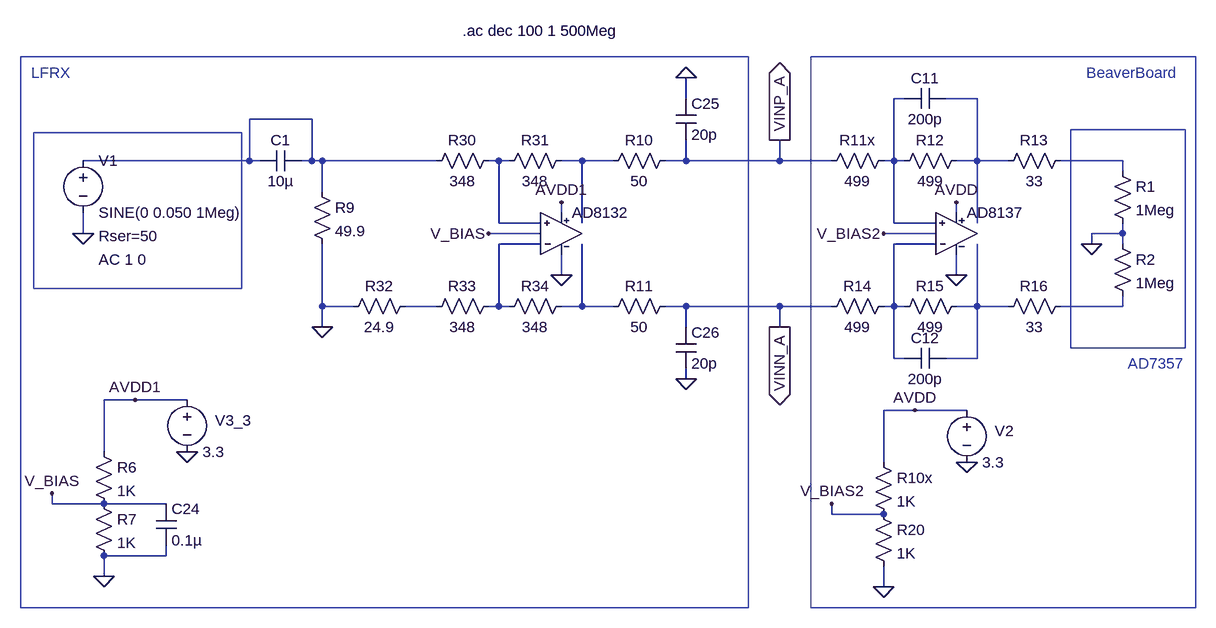
[diagram p0: schematic AD8132-AD8137.asc]
AD8132-AD8137.asc, the LTspice schematic file:
Version 4
SHEET 1 1456 680
WIRE 368 -112 368 -144
WIRE 704 -112 688 -112
WIRE 816 -112 768 -112
WIRE -208 -80 -304 -80
WIRE -304 -16 -304 -80
WIRE -304 -16 -560 -16
WIRE -288 -16 -304 -16
WIRE -208 -16 -208 -80
WIRE -208 -16 -224 -16
WIRE -192 -16 -208 -16
WIRE -16 -16 -192 -16
WIRE 80 -16 64 -16
WIRE 96 -16 80 -16
WIRE 208 -16 176 -16
WIRE 256 -16 208 -16
WIRE 368 -16 368 -48
WIRE 368 -16 336 -16
WIRE 512 -16 512 -48
WIRE 512 -16 368 -16
WIRE 592 -16 512 -16
WIRE 688 -16 688 -112
WIRE 688 -16 672 -16
WIRE 704 -16 688 -16
WIRE 816 -16 816 -112
WIRE 816 -16 784 -16
WIRE 864 -16 816 -16
WIRE 1040 -16 944 -16
WIRE 1040 0 1040 -16
WIRE -192 32 -192 -16
WIRE 176 64 176 48
WIRE 784 64 784 48
WIRE 80 80 80 -16
WIRE 144 80 80 80
WIRE 208 80 208 -16
WIRE 688 80 688 -16
WIRE 752 80 688 80
WIRE 816 80 816 -16
WIRE -560 96 -560 64
WIRE 144 96 64 96
WIRE 752 96 672 96
WIRE 1040 96 1040 80
WIRE 1040 96 992 96
WIRE 144 112 80 112
WIRE 752 112 688 112
WIRE 992 112 992 96
WIRE 1040 112 1040 96
WIRE 176 160 176 128
WIRE 784 160 784 128
WIRE -192 208 -192 112
WIRE -144 208 -192 208
WIRE -16 208 -64 208
WIRE 80 208 80 112
WIRE 80 208 64 208
WIRE 96 208 80 208
WIRE 208 208 208 112
WIRE 208 208 176 208
WIRE 256 208 208 208
WIRE 368 208 336 208
WIRE 512 208 368 208
WIRE 592 208 512 208
WIRE 688 208 688 112
WIRE 688 208 672 208
WIRE 704 208 688 208
WIRE 816 208 816 112
WIRE 816 208 784 208
WIRE 864 208 816 208
WIRE 1040 208 1040 192
WIRE 1040 208 944 208
WIRE -192 240 -192 208
WIRE 368 240 368 208
WIRE 512 240 512 208
WIRE 688 288 688 208
WIRE 704 288 688 288
WIRE 816 288 816 208
WIRE 816 288 768 288
WIRE 368 320 368 304
WIRE -480 352 -528 352
WIRE -400 352 -480 352
WIRE 720 368 672 368
WIRE 800 368 720 368
WIRE -528 432 -528 352
WIRE 672 448 672 368
WIRE -608 512 -608 496
WIRE -528 512 -608 512
WIRE -432 512 -528 512
WIRE 592 528 592 512
WIRE 672 528 592 528
WIRE -432 592 -432 576
WIRE -432 592 -528 592
WIRE -528 624 -528 592
WIRE 672 640 672 608
FLAG 512 240 VINN_A
IOPIN 512 240 Out
FLAG 512 -48 VINP_A
IOPIN 512 -48 Out
FLAG -560 96 0
FLAG -480 352 AVDD1
FLAG -400 432 0
FLAG 176 48 AVDD1
FLAG 176 160 0
FLAG -528 624 0
FLAG -608 496 V_BIAS
FLAG 64 96 V_BIAS
FLAG 368 -144 0
FLAG 368 320 0
FLAG 784 48 AVDD
FLAG 784 160 0
FLAG 672 96 V_BIAS2
FLAG 720 368 AVDD
FLAG 800 448 0
FLAG 672 640 0
FLAG 592 512 V_BIAS2
FLAG 992 112 0
FLAG -192 240 0
SYMBOL res 80 192 R90
WINDOW 0 0 56 VBottom 0
WINDOW 3 32 56 VTop 0
SYMATTR InstName R33
SYMATTR Value 348
SYMATTR SpiceLine tol=1 pwr=0.1
SYMBOL res 80 -32 R90
WINDOW 0 0 56 VBottom 0
WINDOW 3 32 56 VTop 0
SYMATTR InstName R30
SYMATTR Value 348
SYMATTR SpiceLine tol=1 pwr=0.1
SYMBOL res 192 192 R90
WINDOW 0 0 56 VBottom 0
WINDOW 3 32 56 VTop 0
SYMATTR InstName R34
SYMATTR Value 348
SYMATTR SpiceLine tol=1 pwr=0.1
SYMBOL res 192 -32 R90
WINDOW 0 0 56 VBottom 0
WINDOW 3 32 56 VTop 0
SYMATTR InstName R31
SYMATTR Value 348
SYMATTR SpiceLine tol=1 pwr=0.1
SYMBOL voltage -560 -32 R0
WINDOW 123 24 168 Left 0
WINDOW 39 24 132 Left 0
SYMATTR Value2 AC 1 0
SYMATTR SpiceLine Rser=50
SYMATTR InstName V1
SYMATTR Value SINE(0 0.050 1Meg)
SYMBOL voltage -400 336 R0
WINDOW 123 0 0 Left 0
WINDOW 39 0 0 Left 0
WINDOW 0 43 48 Left 0
SYMATTR InstName V3_3
SYMATTR Value 3.3
SYMBOL ad8132 176 96 R0
SYMATTR InstName AD8132
SYMBOL res -544 416 R0
SYMATTR InstName R6
SYMATTR Value 1K
SYMATTR SpiceLine tol=1 pwr=0.1
SYMBOL res -544 496 R0
SYMATTR InstName R7
SYMATTR Value 1K
SYMATTR SpiceLine tol=1 pwr=0.1
SYMBOL cap -448 512 R0
SYMATTR InstName C24
SYMATTR Value 0.1µ
SYMBOL res -208 16 R0
SYMATTR InstName R9
SYMATTR Value 49.9
SYMBOL res -48 192 R90
WINDOW 0 0 56 VBottom 0
WINDOW 3 32 56 VTop 0
SYMATTR InstName R32
SYMATTR Value 24.9
SYMBOL res 352 -32 R90
WINDOW 0 0 56 VBottom 0
WINDOW 3 32 56 VTop 0
SYMATTR InstName R10
SYMATTR Value 50
SYMBOL res 352 192 R90
WINDOW 0 0 56 VBottom 0
WINDOW 3 32 56 VTop 0
SYMATTR InstName R11
SYMATTR Value 50
SYMBOL cap 352 -112 R0
SYMATTR InstName C25
SYMATTR Value 20p
SYMBOL cap 352 240 R0
SYMATTR InstName C26
SYMATTR Value 20p
SYMBOL res 688 192 R90
WINDOW 0 0 56 VBottom 0
WINDOW 3 32 56 VTop 0
SYMATTR InstName R14
SYMATTR Value 499
SYMATTR SpiceLine tol=1 pwr=0.1
SYMBOL res 688 -32 R90
WINDOW 0 0 56 VBottom 0
WINDOW 3 32 56 VTop 0
SYMATTR InstName R11x
SYMATTR Value 499
SYMATTR SpiceLine tol=1 pwr=0.1
SYMBOL res 800 192 R90
WINDOW 0 0 56 VBottom 0
WINDOW 3 32 56 VTop 0
SYMATTR InstName R15
SYMATTR Value 499
SYMATTR SpiceLine tol=1 pwr=0.1
SYMBOL res 800 -32 R90
WINDOW 0 0 56 VBottom 0
WINDOW 3 32 56 VTop 0
SYMATTR InstName R12
SYMATTR Value 499
SYMATTR SpiceLine tol=1 pwr=0.1
SYMBOL res 960 -32 R90
WINDOW 0 0 56 VBottom 0
WINDOW 3 32 56 VTop 0
SYMATTR InstName R13
SYMATTR Value 33
SYMBOL res 960 192 R90
WINDOW 0 0 56 VBottom 0
WINDOW 3 32 56 VTop 0
SYMATTR InstName R16
SYMATTR Value 33
SYMBOL voltage 800 352 R0
WINDOW 123 0 0 Left 0
WINDOW 39 0 0 Left 0
WINDOW 0 43 48 Left 0
SYMATTR InstName V2
SYMATTR Value 3.3
SYMBOL res 656 432 R0
SYMATTR InstName R10x
SYMATTR Value 1K
SYMATTR SpiceLine tol=1 pwr=0.1
SYMBOL res 656 512 R0
SYMATTR InstName R20
SYMATTR Value 1K
SYMATTR SpiceLine tol=1 pwr=0.1
SYMBOL cap 768 -128 R90
WINDOW 0 0 32 VBottom 0
WINDOW 3 32 32 VTop 0
SYMATTR InstName C11
SYMATTR Value 200p
SYMBOL cap 768 272 R90
WINDOW 0 0 32 VBottom 0
WINDOW 3 32 32 VTop 0
SYMATTR InstName C12
SYMATTR Value 200p
SYMBOL ad8137 784 96 R0
SYMATTR InstName AD8137
SYMBOL res 1024 -16 R0
SYMATTR InstName R1
SYMATTR Value 1Meg
SYMBOL res 1024 96 R0
SYMATTR InstName R2
SYMATTR Value 1Meg
SYMBOL cap -224 -32 R90
WINDOW 0 0 32 VBottom 0
WINDOW 3 32 32 VTop 0
SYMATTR InstName C1
SYMATTR Value 10µ
TEXT 24 -216 Left 0 !.ac dec 100 1 500Meg
TEXT -640 -152 Left 0 ;LFRX
TEXT 984 -152 Left 0 ;BeaverBoard
TEXT 1048 296 Left 0 ;AD7357
RECTANGLE Normal -636 181 -316 -59
RECTANGLE Normal -656 672 464 -176
RECTANGLE Normal 1152 672 560 -176
RECTANGLE Normal 1136 272 960 -64

The netlist it stands for:
* AD8132-AD8137.asc
R33 N007 N009 348 tol=1 pwr=0.1
R30 N004 N003 348 tol=1 pwr=0.1
R34 N010 N007 348 tol=1 pwr=0.1
R31 N005 N004 348 tol=1 pwr=0.1
V1 N003 0 SINE(0 0.050 1Meg) AC 1 0 Rser=50
V3_3 AVDD1 0 3.3
XAD8132 N004 N007 AVDD1 0 N005 N010 V_BIAS AD8132  ; pins In+ In- V+ V- OUT- OUT+ VOCM
R6 AVDD1 V_BIAS 1K tol=1 pwr=0.1
R7 V_BIAS 0 1K tol=1 pwr=0.1
C24 V_BIAS 0 0.1µ
R9 N003 0 49.9
R32 N009 0 24.9
R10 VINP_A N005 50
R11 VINN_A N010 50
C25 0 VINP_A 20p
C26 VINN_A 0 20p
R14 N008 VINN_A 499 tol=1 pwr=0.1
R11x N001 VINP_A 499 tol=1 pwr=0.1
R15 N011 N008 499 tol=1 pwr=0.1
R12 N002 N001 499 tol=1 pwr=0.1
R13 N006 N002 33
R16 N012 N011 33
V2 AVDD 0 3.3
R10x AVDD V_BIAS2 1K tol=1 pwr=0.1
R20 V_BIAS2 0 1K tol=1 pwr=0.1
C11 N002 N001 200p
C12 N011 N008 200p
XAD8137 N001 N008 AVDD 0 N011 N002 V_BIAS2 AD8137  ; pins In+ In- V+ V- OUT+ OUT- VOCM
R1 N006 0 1Meg
R2 0 N012 1Meg
C1 N003 N003 10µ
.ac dec 100 1 500Meg
* LFRX
* BeaverBoard
* AD7357
.lib ad8132.cir
.lib ad8137.cir
.backanno
.end